# EAGLE design UPDIMOD-v1_0 (EAGLE 9.7.0)
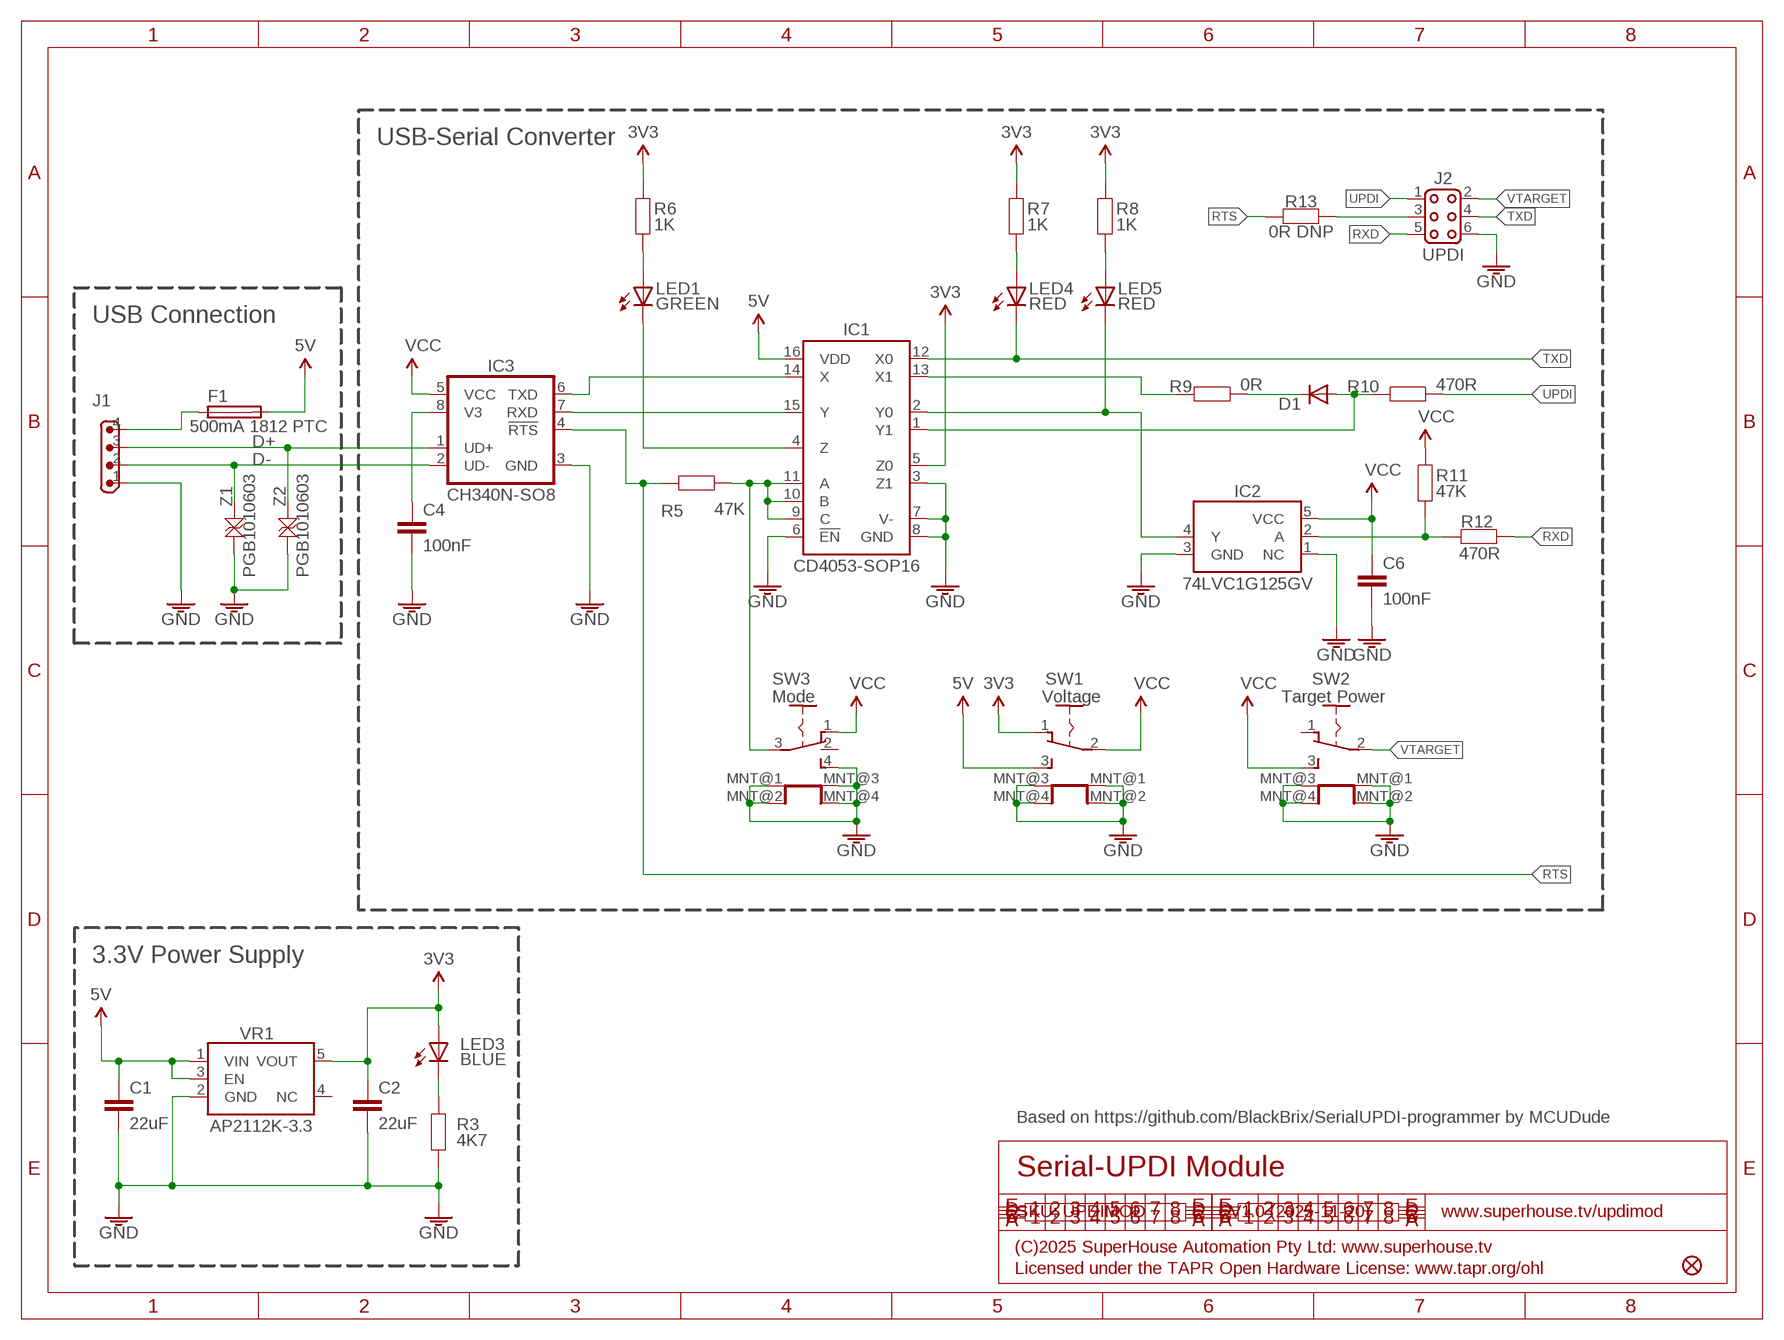
[diagram p0: schematic, sheet 1]

## Parts
C1  22uF  CAP0805  [C0805]
C2  22uF  CAP0805  [C0805]
C4  100nF  CAP0603  [C0603]
C6  100nF  CAP0603  [C0603]
D1  DIODE-SOD123  [SOD-123]
F1  500mA 1812 PTC  PTC-1206  [1206]
FID2  FIDUCIAL1X2.5  [FIDUCIAL-1X2.5]
IC1  CD4053-SOP16  [SO16]
IC2  74LVC1G125GV  74AHC1G14GW-SOT235  [SOT23-5]
IC3  CH340N-SO8  [SOIC8]
J1  M04-PIN-BELOW  [1X04-P-BELOW]
J2  UPDI  M02X3-SOCKET-BELOW  [2X03-S-BELOW]
LED1  GREEN  LED0603  [LED-0603]
LED3  BLUE  LED0603  [LED-0603]
LED4  RED  LED0603  [LED-0603]
LED5  RED  LED0603  [LED-0603]
R3  4K7  RESISTOR0603  [R0603]
R5  47K  RESISTOR0603  [R0603]
R6  1K  RESISTOR0603  [R0603]
R7  1K  RESISTOR0603  [R0603]
R8  1K  RESISTOR0603  [R0603]
R9  0R  RESISTOR0603  [R0603]
R10  470R  RESISTOR0603  [R0603]
R11  47K  RESISTOR0603  [R0603]
R12  470R  RESISTOR0603  [R0603]
R13  0R DNP  RESISTOR0603  [R0603]
SW1  Voltage  SWITCH-SPDT-4TABSSMT  [MK-12C02]
SW2  Target Power  SWITCH-SPDT-4TABSSMT  [MK-12C02]
SW3  Mode  SWITCH-SP3T-4TABS  [MK-13C02]
VR1  AP2112K-3.3  AP2112KSOT25  [SOT23-5]
Z1  PGB1010603  TVS0603  [TVS0603]
Z2  PGB1010603  TVS0603  [TVS0603]

## Nets
3.3V: C2.1 IC1.5(Z0) LED3.A R6.2 R7.2 R8.2 SW1.1(A) VR1.5(VOUT)
5V: C1.1 F1.2 IC1.16(VDD) SW1.3(B) VR1.1(VIN) VR1.3(EN)
D+: IC3.1(UD+) J1.3 Z2.2
D-: IC3.2(UD-) J1.2 Z1.2
GND: C1.2 C2.2 C4.2 C6.2 IC1.3(Z1) IC1.6(!EN) IC1.7(V-) IC1.8(GND) IC2.1(NC) IC2.3(GND) IC3.3(GND) J1.1 J2.6 R3.1 SW1.MNT@1(MNT) SW1.MNT@2(MNT) SW1.MNT@3(MNT) SW1.MNT@4(MNT) SW2.MNT@1(MNT) SW2.MNT@2(MNT) SW2.MNT@3(MNT) SW2.MNT@4(MNT) SW3.4(C) SW3.MNT@1(MNT) SW3.MNT@2(MNT) SW3.MNT@3(MNT) SW3.MNT@4(MNT) VR1.2(GND) Z1.1 Z2.1
N$2: C4.1 IC3.8(V3)
N$3: LED1.A R6.1
N$4: IC1.4(Z) LED1.C
N$5: LED3.C R3.2
N$6: IC1.14(X) IC3.6(TXD)
N$7: IC1.15(Y) IC3.7(RXD)
N$8: LED5.A R8.1
N$9: IC1.9(C) IC1.10(B) IC1.11(A) R5.1 SW3.3(COM)
N$10: LED4.A R7.1
N$11: IC1.13(X1) R9.2
N$12: IC1.2(Y0) IC2.4(Y) LED5.C
N$13: D1.1(C) R9.1
N$14: D1.2(A) IC1.1(Y1) R10.2
N$15: IC2.2(A) R11.1 R12.2
N$16: J2.3 R13.1
RTS: IC3.4(!RTS) R5.2 R13.2
RXD: J2.5 R12.1
TXD: IC1.12(X0) J2.4 LED4.C
UPDI: J2.1 R10.1
VCC: C6.1 IC2.5(VCC) IC3.5(VCC) R11.2 SW1.2(COM) SW2.3(B) SW3.1(A)
VIN: F1.1 J1.4
VTARGET: J2.2 SW2.2(COM)
Unconnected: SW2.1(A) SW3.2(B) VR1.4(NC)

## Notes on the sheet
- USB-Serial Converter
- USB Connection
- 3.3V Power Supply
- Based on https://github.com/BlackBrix/SerialUPDI-programmer by MCUDude
- Serial-UPDI Module
- SKU: UPDIMOD | V1.0 (2025-11-20) | www.superhouse.tv/updimod
- (C)2025 SuperHouse Automation Pty Ltd: www.superhouse.tv
- Licensed under the TAPR Open Hardware License: www.tapr.org/ohl

## Library data of the parts
C1 C2 = SuperHouse-Capacitors:CAP: Capacitor Standard ceramic capacitor
C4 C6 = SuperHouse-DiscreteSemi:CAP: Capacitor Standard ceramic capacitor
D1 = SuperHouse-Diodes:DIODE: Diode Standard reverse protection diodes and small signal diodes. SMA package can handle up to about 1A. SOD-323 can handle about 200mA.
F1 = SuperHouse-Fuses:PTC: Resettable polyfuses
FID2 = SuperHouse-Symbols:FIDUCIAL: Fiducial Alignment Points Various fiducial points for machine vision alignment.
IC1 = SuperHouse-ICs:CD4053
IC2 = SuperHouse-ICs:74AHC1G14GW: 74AHCT1G14 inverting Schmitt trigger
IC3 = SuperHouse-ICs:CH340N
J1 = SuperHouse-Connectors:M04: 4-way header Standard 1x4 header, and screw terminal variations
J2 = SuperHouse-Connectors:M02X3: M6 header in 2x3 format
LED1 LED3-LED5 = SuperHouse-LEDs:LED: LEDs in various sizes including 5mm and 3mm PTH, and 0402, 0603, 0805, etc SMT
R3 R5-R13 = SuperHouse-DiscreteSemi:RESISTOR: Resistor Standard resistors.
SW1 SW2 = SuperHouse-Switches:SWITCH-SPDT-4TABS
SW3 = SuperHouse-Switches:SWITCH-SP3T-4TABS
VR1 = SuperHouse-Regulators:AP2112K: AP2112K LDO linear voltage regulator
Z1 Z2 = SuperHouse-DiscreteSemi:TVS: TVS voltage protection Zener

## Net classes
0 default: width 0.152 mm, drill 0.241 mm, clearance 0.152 mm

## Board
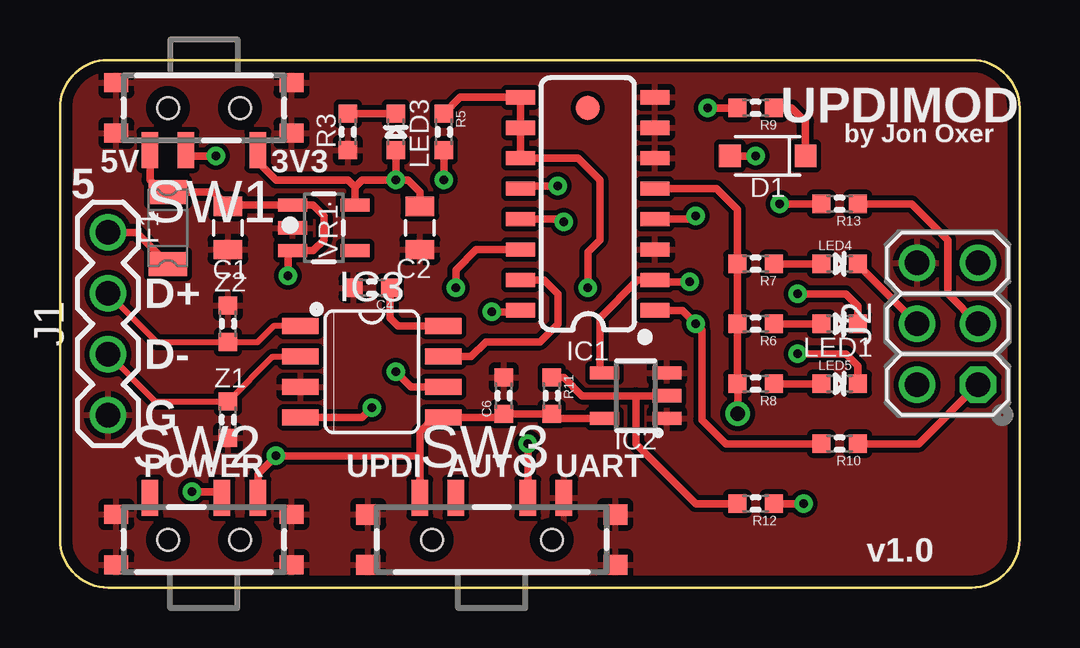
[diagram p1: board, top side]
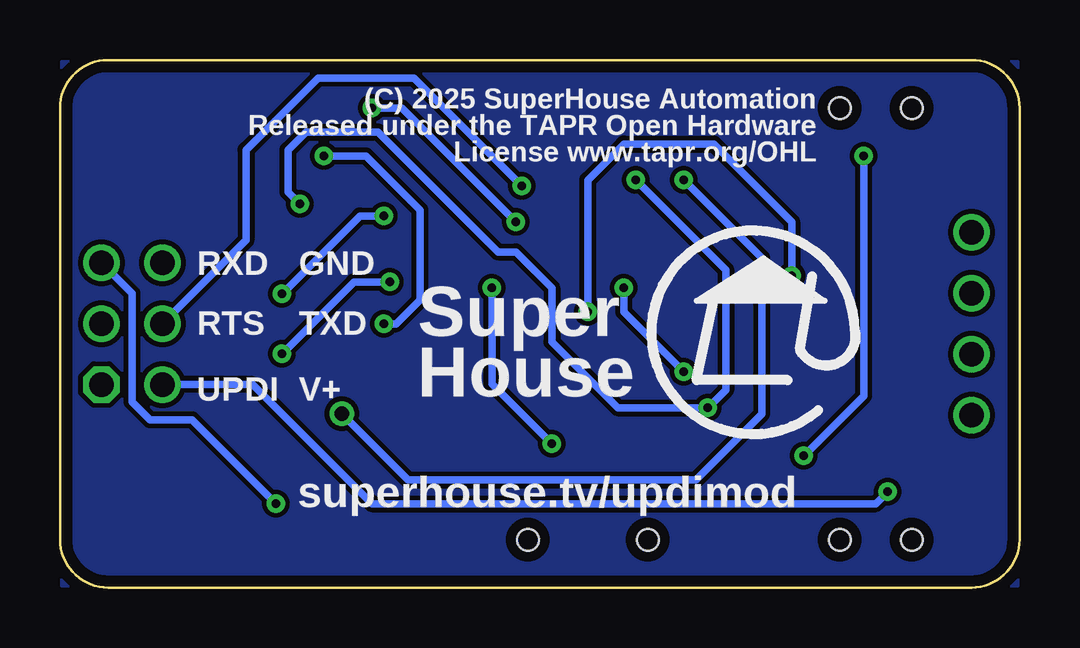
[diagram p2: board, bottom side, seen from below]

Size 40 x 22 mm. Coordinates in mm from the lower left corner, seen from the top.
Outline: 40,2 40,20 arc90 38,22 2,22 arc90 0,20 0,2 arc90 2,0 38,0 arc90 40,2
Copper layers (1*16): Top 0.035mm / dielectric 1.5mm / Bottom 0.035mm
Design rules "SuperHouse-Design-Rules": minimum track width 10mil, minimum drill 24mil, track to track 8mil, track to pad 8mil, pad to pad 8mil, via to via 8mil, smd to smd 6mil, copper to edge 18mil, drill to drill 8mil, minimum pad ring 7mil, minimum via ring 8mil, stop-mask expansion 4mil, vias tented up to drill 0.5mm, thermal gap 10mil

### Footprints (pad centres in the part's own frame; a part is rotated, then mirrored left to right if it is on the bottom)
C0805 = smd 0.8 x 1.2: 1 -0.9,0; 2 0.9,0
C0603 = smd 0.762 x 0.762: 1 -0.762,0; 2 0.762,0
SOD-123 = smd 0.9 x 0.95: 1 -1.575,0; 2 1.575,0
1206 = smd 1 x 1.6: 1 -1.5,0; 2 1.5,0
FIDUCIAL-1X2.5 = smd 1 x 1: 1 0,0
SO16 = smd 1.2 x 0.6: 1 -2.8,4.445; 2 -2.8,3.175; 3 -2.8,1.905; 4 -2.8,0.635; 5 -2.8,-0.635; 6 -2.8,-1.905; 7 -2.8,-3.175; 8 -2.8,-4.445; 9 2.8,-4.445; 10 2.8,-3.175; 11 2.8,-1.905; 12 2.8,-0.635; 13 2.8,0.635; 14 2.8,1.905; 15 2.8,3.175; 16 2.8,4.445
SOT23-5 = smd 1.2 x 0.55: 1 -1.3,0.95; 2 -1.3,0; 3 -1.3,-0.95; 4 1.3,-0.95; 5 1.3,0.95
SOIC8 = smd 1.524 x 0.66: 1 -2.973,1.905; 2 -2.973,0.635; 3 -2.973,-0.635; 4 -2.973,-1.905; 5 2.973,-1.905; 6 2.973,-0.635; 7 2.973,0.635; 8 2.973,1.905
1X04-P-BELOW = drill 1.016: 1 -3.81,0; 2 -1.27,0; 3 1.27,0; 4 3.81,0
2X03-S-BELOW = drill 1.016 octagon: 1 -2.54,-1.27 | drill 1.016: 2 -2.54,1.27; 3 0,-1.27; 4 0,1.27; 5 2.54,-1.27; 6 2.54,1.27
LED-0603 = smd 0.762 x 0.762: A -0.762,0; C 0.762,0
R0603 = smd 0.762 x 0.762: 1 -0.762,0; 2 0.762,0
MK-12C02 = smd 0.7 x 1.5: 1 -2.25,1.75; 2 0.75,1.75; 3 2.25,1.75 | smd 1 x 0.8: MNT@1 -3.65,1.05; MNT@2 -3.65,-1.05; MNT@3 3.65,1.05; MNT@4 3.65,-1.05 | hole 0.9: -1.5,0; 1.5,0
MK-13C02 = smd 0.7 x 1.5: 1 -3,1.75; 2 -1.5,1.75; 3 1.5,1.75; 4 3,1.75 | smd 1 x 0.85: MNT@1 -5.15,1.05; MNT@2 -5.15,-1.05; MNT@3 5.15,1.05; MNT@4 5.15,-1.05 | hole 0.9: -2.5,0; 2.5,0
SOT23-5' = smd 0.55 x 1.2: 1 -0.95,-1.3; 2 0,-1.3; 3 0.95,-1.3; 4 0.95,1.3; 5 -0.95,1.3
TVS0603 = smd 0.762 x 0.762: 1 -0.762,0; 2 0.762,0

### Placement (x,y rotation side)
C1  7,15 270 top
C2  15,15 270 top
C4  13,12.5 180 top
C6  18.5,8 90 top
D1  29.5,18 180 top
F1  4.5,15 90 top
FID2  22,20 0 top
IC1  22,16 180 top
IC2  24,8 180 top
IC3  13,9 0 top
J1  2,11 90 top
J2  37,11 90 top
LED1  32.5,11 0 top
LED3  14,19 90 top
LED4  32.5,13.5 0 top
LED5  32.5,8.5 0 top
R3  12,19 90 top
R5  16,19 270 top
R6  29,11 180 top
R7  29,13.5 180 top
R8  29,8.5 180 top
R9  29,20 180 top
R10  32.5,6 180 top
R11  20.5,8 270 top
R12  29,3.5 180 top
R13  32.5,16 180 top
SW1  6,20 180 top
SW2  6,2 0 top
SW3  18,2 0 top
VR1  AP2112K-3.3  [SOT23-5']  11,15 270 top
Z1  7,7 90 top
Z2  7,11 270 top

### Tracks (layer width: path | path; a pad name or v marks a point on that pad's centre or on a via)
3.3V  (via drill 0.35, 0.61)
  Top 0.305: 15.1,16 C2.1 | VR1.5 12.3,16.7 | 12.3,16.7 12,17 9,17 8.25,17.75 SW1.1 | IC1.5 27.36,16.64 28.24,15.76 R7.2 R6.2 R8.2 28.25,8.49 v28.25,7.25 | v14,17 LED3.A | C2.1 15,16.5 14.5,17 v14,17 | 14.95,15.95 C2.1 | v14,17 12.6,17 12.3,16.7
  Bottom 0.305: v28.25,7.25 25.5,4.5 13.5,4.5 10.75,7.25 10.75,13.75 v14,17
5V  (via drill 0.35)
  Top 0.305: SW1.3 3.75,17 4.25,16.5 F1.2 6.4,16.5 C1.1 7.05,15.95 VR1.1 10.55,15.95 11,15.5 11,14.5 10.55,14.05 VR1.3 9.5,13.85 v9.5,13 | IC1.16 19.14,11.5 v18,11.5
  Bottom 0.305: v18,11.5 18,17 16.5,18.5 12.75,18.5 9.5,15.25 v9.5,13
D+
  Top 0.254: J1.3 4.03,10.24 Z2.2 8.24,10.24 8.9,10.9 IC3.1
D-
  Top 0.254: IC3.2 8.87,9.63 Z1.2 3.97,7.76 J1.2
GND
  pour Top: 0.08,0.08 39.92,0.08 39.92,21.92 0.08,21.92
N$1
  pour Bottom: 0.08,0.08 39.92,0.08 39.92,21.92 0.08,21.92
N$2
  Top 0.305: C4.1 13.76,11.24 14.1,10.9 IC3.8
N$3
  Top 0.305: LED1.A R6.1
N$4  (via drill 0.35)
  Top 0.305: LED1.C 33.26,11.74 32.75,12.25 v30.75,12.25 | v26.5,15.5 26.36,15.37 IC1.4
  Bottom 0.305: v30.75,12.25 27.5,15.5 v26.5,15.5
N$5
  Top 0.305: LED3.C R3.2
N$6  (via drill 0.35)
  Top 0.305: v16.5,12.5 16.5,13.25 17.34,14.1 IC1.14 | IC3.6 14.63,8.37 v14,9
  Bottom 0.305: v16.5,12.5 16.5,11.5 v14,9
N$7
  Top 0.305: IC3.7 17.14,9.63 17.75,10.25 20,10.25 20.75,11 20.75,12.25 20.18,12.82 IC1.15
N$8
  Top 0.305: R8.1 LED5.A
N$9  (via drill 0.35)
  Top 0.305: R5.1 16.68,20.45 IC1.9 IC1.10 IC1.11 21.59,17.91 22.5,17 22.5,14.5 22,14 v22,12.5 | SW3.3 v19.5,6
  Bottom 0.305: v22,12.5 22,8.5 v19.5,6
N$10
  Top 0.305: R7.1 LED4.A
N$11  (via drill 0.35)
  Top 0.305: R9.2 v27,20 | v21,15.25 20.89,15.37 IC1.13
  Bottom 0.305: v27,20 25.75,20 v21,15.25
N$12  (via drill 0.35)
  Top 0.305: IC2.4 22.5,9.15 22.5,11.25 24.07,12.82 IC1.2 24.88,12.75 v26.25,12.75 | LED5.C 33.26,9.24 32.75,9.75 v30.75,9.75
  Bottom 0.305: v30.75,9.75 27.75,12.75 v26.25,12.75
N$13
  Top 0.305: D1.1 31.07,19.44 30.51,20 R9.1
N$14  (via drill 0.35)
  Top 0.305: R10.2 27.75,6 26.75,7 26.75,10.75 v26.5,11 25.95,11.55 IC1.1 | v29,18 D1.2
  Bottom 0.305: v26.5,11 26,11 25,12 25,15.75 27.25,18 v29,18
N$15
  Top 0.305: R11.1 21,8.76 21.76,8 24,8 | 24,8 IC2.2 | R12.2 26.5,3.5 24,6 24,8
N$16
  Top 0.305: J2.3 37,12.27 37,14.5 35.5,16 R13.1
RTS  (via drill 0.35)
  Top 0.305: IC3.4 12.6,7.09 v13,7.5 | v16,17 R5.2 | R13.2 v30,16
  Bottom 0.305: v16,17 12.25,13.25 12.25,8.25 v13,7.5 16.75,7.5 19.5,10.25 19.5,12.5 21,14 21.75,14 26.75,19 29.75,19 30.5,18.25 30.5,16.5 v30,16
RXD  (via drill 0.35)
  Top 0.305: R12.1 v31,3.5
  Bottom 0.305: v31,3.5 34.5,7 36.25,7 37,7.75 37,12.27 J2.5
TXD  (via drill 0.35)
  Top 0.305: J2.4 33.26,13.47 LED4.C | IC1.12 19.32,16.75 v20.75,16.75
  Bottom 0.305: v20.75,16.75 25.25,21.25 29.25,21.25 32.25,18.25 32.25,14.48 J2.4
UPDI
  Top 0.305: J2.1 35.81,6 R10.1
VCC  (via drill 0.35)
  Top 0.305: 18.69,7.05 C6.1 | C6.1 18.36,7.09 IC3.5 15.6,7.09 15,6.5 15,5.5 | SW2.3 8.25,4.75 v9,5.5 15,5.5 | v6.5,18 5.5,18 SW1.2 | C6.1 R11.2 20.69,7.05 IC2.5 | SW3.1 15,5.5
  Bottom 0.305: v9,5.5 6.5,8 v6.5,18
VIN
  Top 0.305: F1.1 3.19,14.81 J1.4
VTARGET  (via drill 0.35)
  Top 0.305: SW2.2 6.5,4 v5.5,4
  Bottom 0.305: v5.5,4 6,3.5 27,3.5 31.96,8.46 J2.2

### Text on the board
tPlace: UPDIMOD | by Jon Oxer | 5 | 5V | 3V3 | D+ | D- | G | POWER | UPDI | AUTO | UART | v1.0
bPlace: (C) 2025 SuperHouse Automation / Released under the TAPR Open Hardware / License www.tapr.org/OHL | GND | RXD | TXD | RTS | Super / House | V+ | UPDI | superhouse.tv/updimod
tValues: K | A | K | A | K | A